# Altium schematic sheet 07 MCU_LINK.SchDoc
size 513 x 386 mm
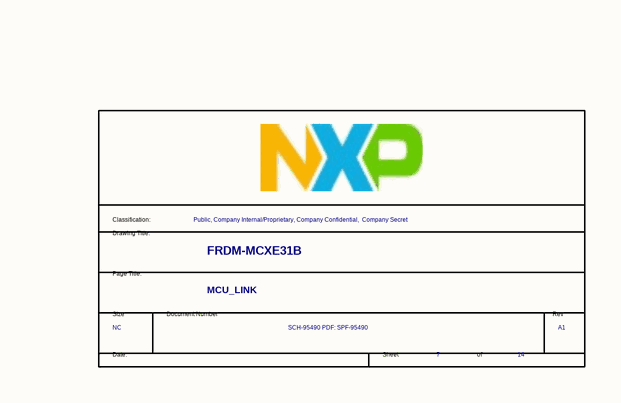
[diagram p0: 07 MCU_LINK.SchDoc, right]

## Parts
*  Title: FRDM-MCXE31B  RevCode: A1  PageTitle: MCU_LINK  Page Size: NC  Page Number: 7  Page Count: 14  Doc: SCH-95490 PDF: SPF-95490  Classification: Public, Company Internal/Proprietary, Company Confidential,  Company Secret  (hidden comment: TitleBlock_FS)  (graphical)

## Notes on the sheet
- (in symbol TitleBlock_FS) Classification:; Drawing Title:; Page Title:; Size; Document Number; Rev; Date:; Sheet; of

## Library data of the parts
* = TitleBlock_FS: Variant Name: <Core Design>; OrgAddr2: Austin, TX 78735-8598; OrgAddr1: 6501 William Cannon Drive West; OrgName: NXP Semiconductors; Classification: Company Internal/Proprietary; Page Create Date: March  8, 1995